# EAGLE schematic clock1 (EAGLE 7.1.0)
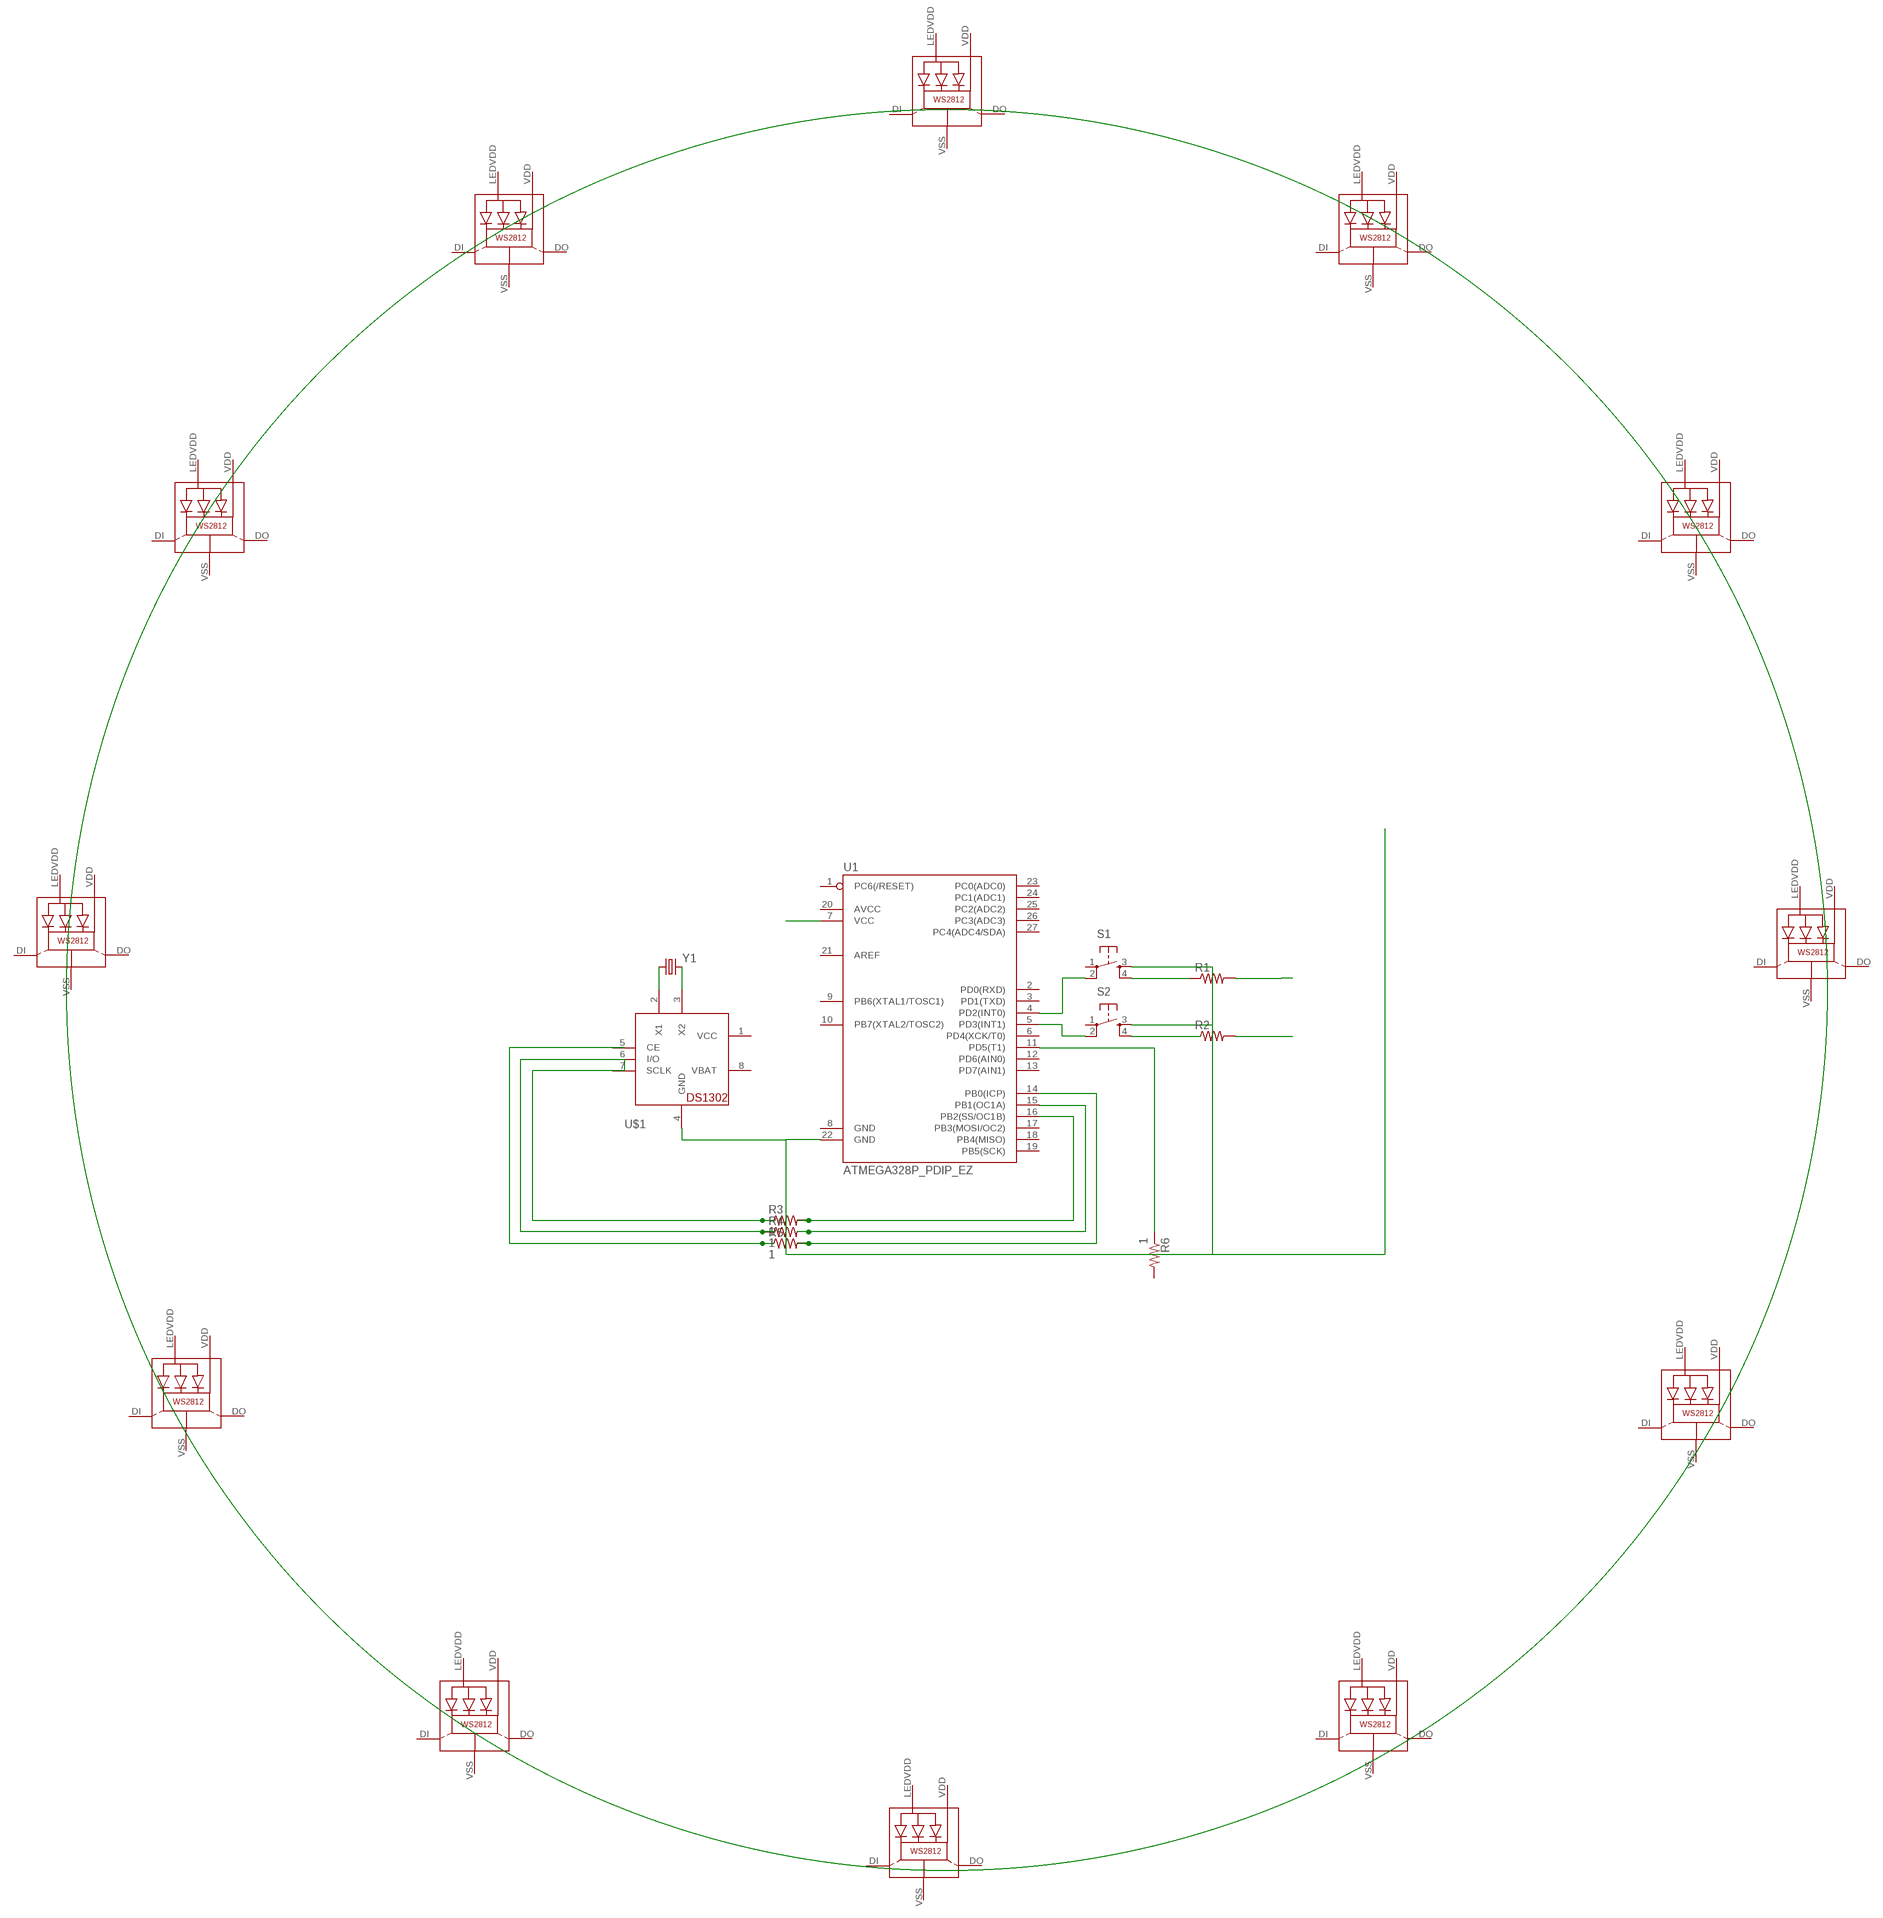
[diagram p0: schematic, sheet 1]

## Parts
LED1  WS2812  [WS2812]
LED2  WS2812  [WS2812]
LED3  WS2812  [WS2812]
LED4  WS2812  [WS2812]
LED5  WS2812  [WS2812]
LED6  WS2812  [WS2812]
LED7  WS2812  [WS2812]
LED8  WS2812  [WS2812]
LED9  WS2812  [WS2812]
LED10  WS2812  [WS2812]
LED11  WS2812  [WS2812]
LED12  WS2812  [WS2812]
R1  1KOHM1/4W5%(PTH)  [AXIAL-0.3]
R2  1KOHM1/4W5%(PTH)  [AXIAL-0.3]
R3  1  1OHM1/10W1%(0603)  [0603-RES]
R4  1  1OHM1/10W1%(0603)  [0603-RES]
R5  1  1OHM1/10W1%(0603)  [0603-RES]
R6  1  1OHM1/10W1%(0603)  [0603-RES]
S1  TAC_SWITCHPTH  [TACTILE-PTH]
S2  TAC_SWITCHPTH  [TACTILE-PTH]
U1  ATMEGA328P_PDIP_EZ  [DIL28-EZ]
U$1  DS1302  [DIL08-ROUND]
Y1  CRYSTALTC38H  [TC38H]

## Nets
N$1: S1.2 U1.4(PD2(INT0))
N$2: S2.2 U1.5(PD3(INT1))
N$3: R6.1 U1.11(PD5(T1))
N$4: S2.4
N$5: R1.P$1 S1.4
N$6: U1.7(VCC)
N$7: U$1.3(X2) Y1.2
N$8: U$1.2(X1) Y1.1
N$9: R3.2 U1.16(PB2(SS/OC1B))
N$10: R5.1
N$11: R5.2 U1.14(PB0(ICP))
N$12: R4.2 U1.15(PB1(OC1A))
N$13: R3.1 R4.1 U$1.6(I/O)
N$20: S1.3 S2.3 U1.22(GND) U$1.4(GND)
VCC: R1.P$2 R2.P$2
Unconnected: LED1.DI LED1.DO LED2.DI LED2.DO LED3.DI LED3.DO LED4.DI LED4.DO LED5.DI LED5.DO LED6.DI LED6.DO LED7.DI LED7.DO LED8.DI LED8.DO LED9.DI LED9.DO LED10.DI LED10.DO LED11.DI LED11.DO LED12.DI LED12.DO R2.P$1 R6.2 S1.1 S2.1 U1.1(PC6(/RESET)) U1.2(PD0(RXD)) U1.3(PD1(TXD)) U1.6(PD4(XCK/T0)) U1.8(GND) U1.9(PB6(XTAL1/TOSC1)) U1.10(PB7(XTAL2/TOSC2)) U1.12(PD6(AIN0)) U1.13(PD7(AIN1)) U1.17(PB3(MOSI/OC2)) U1.18(PB4(MISO)) U1.19(PB5(SCK)) U1.20(AVCC) U1.21(AREF) U1.23(PC0(ADC0)) U1.24(PC1(ADC1)) U1.25(PC2(ADC2)) U1.26(PC3(ADC3)) U1.27(PC4(ADC4/SDA)) U$1.5(CE) U$1.7(SCLK)

## Power pins joined to a net without a drawn wire
GND: LED1.VSS(GND) LED2.VSS(GND) LED3.VSS(GND) LED4.VSS(GND) LED5.VSS(GND) LED6.VSS(GND) LED7.VSS(GND) LED8.VSS(GND) LED9.VSS(GND) LED10.VSS(GND) LED11.VSS(GND) LED12.VSS(GND)
LEDVDD: LED1.LEDVDD LED2.LEDVDD LED3.LEDVDD LED4.LEDVDD LED5.LEDVDD LED6.LEDVDD LED7.LEDVDD LED8.LEDVDD LED9.LEDVDD LED10.LEDVDD LED11.LEDVDD LED12.LEDVDD
VBAT: U$1.8(VBAT)
VCC: U$1.1(VCC)
VDD: LED1.VDD LED2.VDD LED3.VDD LED4.VDD LED5.VDD LED6.VDD LED7.VDD LED8.VDD LED9.VDD LED10.VDD LED11.VDD LED12.VDD

## Library data of the parts
LED1-LED12 = adafruit:WS2812
R1 R2 = SparkFun-Resistors:1KOHM1/4W5%(PTH): RES-08380; PROD_ID: RES-08380; VALE: 1k
R3-R6 = SparkFun-Resistors:1OHM1/10W1%(0603): RES-08269; PROD_ID: RES-08269
S1 S2 = SparkFun-Electromechanical:TAC_SWITCH: Momentary Switch Button commonly used for reset or general input. Spark Fun Electronics SKU : COM-00097 SMT- SWCH-08247
U1 = SparkFun-DigitalIC:ATMEGA328P_PDIP_EZ: uC used in the Arduino 32kb flash, 1k EEPROM, 2k SRAM This is the through-hole version of this chip.
U$1 = adafruit:DS1302: DS1302 - Real time clock with supercap trickle charger
Y1 = SparkFun-FreqCtrl:CRYSTAL: Various standard crystals. Proven footprints. Spark Fun Electronics SKU : COM-00534